# Altium schematic sheet WifiNode_Per_R00.SchDoc: WifiNode_Per_R00
size A4; Author: Sfara, Gonzalo Agustín; CompanyName: Introducción al Diseño de Circuitos Impresos; Organization: UTN FRBA; Revision: 00; SheetNumber: 5; SheetTotal: 6
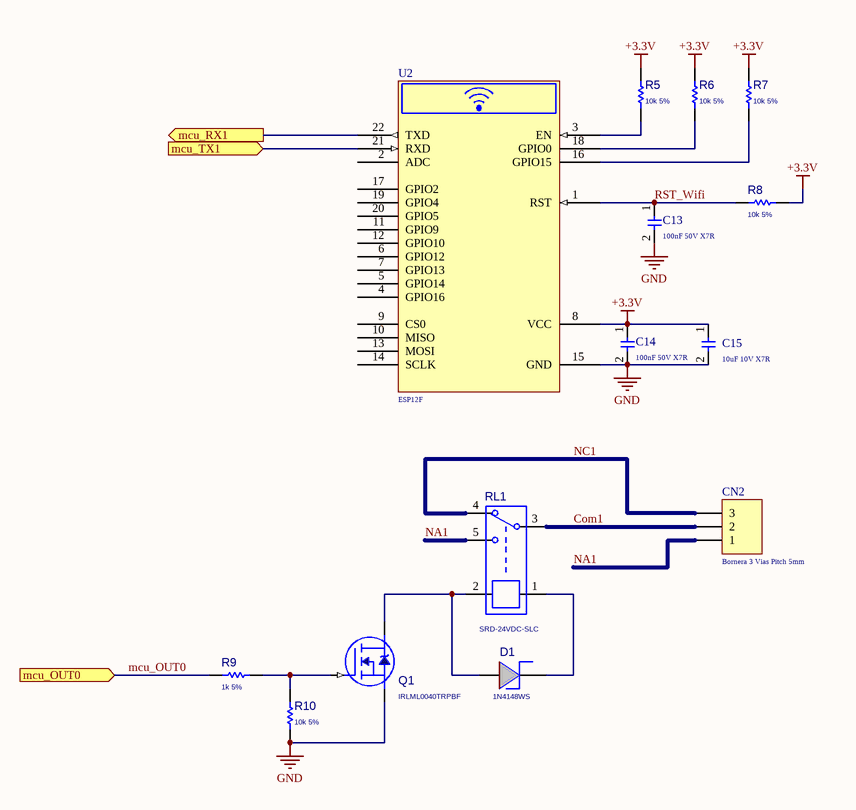
[diagram p0: WifiNode_Per_R00.SchDoc]

## Parts
C13  100nF 50V X7R  [C_0805]
C14  100nF 50V X7R  [C_0805]
C15  10uF 10V X7R  [C_0805]
CN2  Bornera 3 Vias Pitch 5mm  [TerminalBlock_1x3_P5mm]
D1  1N4148WS  [D_0805]
Q1  IRLML0040TRPBF  [SOT_23]
R5  10k 5%  [R_0805]
R6  10k 5%  [R_0805]
R7  10k 5%  [R_0805]
R8  10k 5%  [R_0805]
R9  1k 5%  [C_0805]
R10  10k 5%  [C_0805]
RL1  SRD-24VDC-SLC  [943-1C]
U2  ESP12F  [ESP12F]

## Ports
mcu_OUT0 (in), mcu_RX1 (out), mcu_TX1 (in)

## Nets
+3.3V: C14.1 C15.1 R5.2 R6.2 R7.2 R8.1 U2.8(VCC)
GND: C13.2 C14.2 C15.2 Q1.2(SOURCE) R10.1 U2.15(GND)
Com1: CN2.2 RL1.3
mcu_OUT0: R9.2 ; port mcu_OUT0
mcu_RX1: U2.22(TXD) ; port mcu_RX1
mcu_TX1: U2.21(RXD) ; port mcu_TX1
NA1: CN2.1 RL1.5
NC1: CN2.3 RL1.4
RST_Wifi: C13.1 R8.2 U2.1(RST)
NetD1_1: D1.1(A) Q1.3(DRAIN) RL1.2
NetD1_2: D1.2(K) RL1.1
NetQ1_1: Q1.1(GATE) R9.1 R10.2
NetR5_1: R5.1 U2.3(EN)
NetR6_1: R6.1 U2.18(GPIO0)
NetR7_1: R7.1 U2.16(GPIO15)

Not connected (* = marked no-connect by the designer): U2 2(ADC) 4(GPIO16) 5(GPIO14) 6(GPIO12) 7(GPIO13) 9(CS0) 10(MISO) 11(GPIO9) 12(GPIO10) 13(MOSI) 14(SCLK) 17(GPIO2) 19(GPIO4) 20(GPIO5)

## Notes on the sheet
- Title:
- Size:
- Author:
- A4
- Sheet
- of
- Revision:
- File:
- Date:

## Library data of the parts
C13-C15 = CAP_NP: Not polarized capacitor
CN2 = CONN_03P: Connector Generic 3 Vias
D1 = DIODO_SH: Diode Shottky
Q1 = N_MOSFET_SOT23: Mosfet N-Ch
R5-R10 = Res1: Resistor
RL1 = RELAY SPDT
U2 = ESP12F Wifi Module: Wifi Module